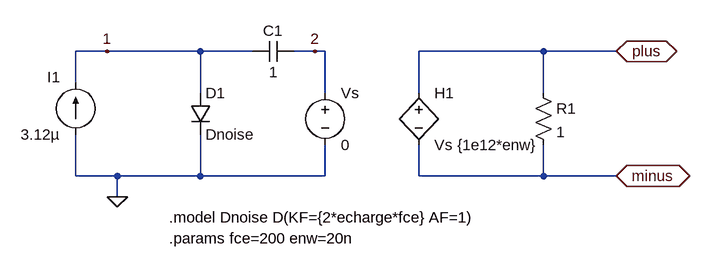
[diagram p0: schematic noisegen.asc]
noisegen.asc, the LTspice schematic file:
Version 4
SHEET 1 948 680
WIRE -16 208 -16 160
WIRE -16 160 32 160
WIRE 320 160 352 160
WIRE 368 160 368 224
WIRE 368 304 368 352
WIRE 368 352 176 352
WIRE -16 352 -16 288
WIRE 176 288 176 352
WIRE 176 352 48 352
WIRE 176 224 176 160
WIRE 176 160 256 160
WIRE 512 304 512 352
WIRE 704 304 704 352
WIRE 704 352 512 352
WIRE 704 224 704 160
WIRE 704 160 512 160
WIRE 512 160 512 224
WIRE 32 160 176 160
WIRE 352 160 368 160
WIRE 48 384 48 352
WIRE 48 352 -16 352
WIRE 704 160 816 160
WIRE 704 352 816 352
FLAG 32 160 1
FLAG 352 160 2
FLAG 48 384 0
FLAG 816 160 plus
IOPIN 816 160 BiDir
FLAG 816 352 minus
IOPIN 816 352 BiDir
SYMBOL current -16 288 R180
WINDOW 0 24 88 Left 0
WINDOW 3 24 0 Left 0
WINDOW 123 0 0 Left 0
WINDOW 39 0 0 Left 0
SYMATTR InstName I1
SYMATTR Value 3.12µ
SYMBOL diode 160 224 R0
SYMATTR InstName D1
SYMATTR Value Dnoise
SYMBOL cap 256 176 R270
WINDOW 0 32 32 VTop 0
WINDOW 3 0 32 VBottom 0
SYMATTR InstName C1
SYMATTR Value 1
SYMBOL voltage 368 208 R0
SYMATTR InstName Vs
SYMATTR Value 0
SYMBOL h 512 208 R0
SYMATTR InstName H1
SYMATTR Value Vs {1e12*enw}
SYMBOL res 688 208 R0
SYMATTR InstName R1
SYMATTR Value 1
TEXT 128 416 Left 0 !.model Dnoise D(KF={2*echarge*fce} AF=1)
TEXT 128 448 Left 0 !.params fce=200 enw=20n

The netlist it stands for:
* noisegen.asc
I1 0 1 3.12µ
D1 1 0 Dnoise
C1 1 2 1
Vs 2 0 0
H1 plus minus Vs {1e12*enw}
R1 plus minus 1
.model D D
.lib standard.dio
.model Dnoise D(KF={2*echarge*fce} AF=1)
.params fce=200 enw=20n
.backanno
.end